# Altium schematic sheet Sheet1.SchDoc
size A; SheetNumber: 1; SheetTotal: 1
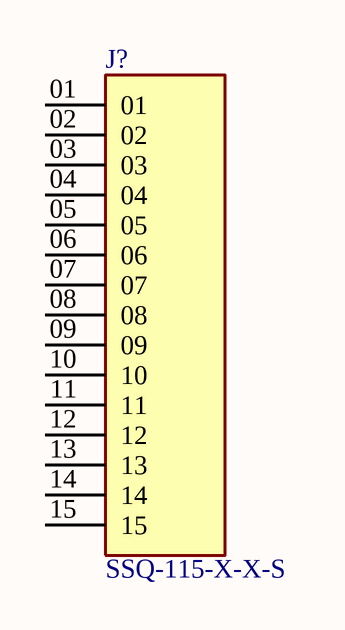
[diagram p0: Sheet1.SchDoc]

## Parts
J?  SSQ-115-X-X-S  [SAMTEC_SSQ-115-X-X-S]

## Nets

Not connected (* = marked no-connect by the designer): J? 01 02 03 04 05 06 07 08 09 10 11 12 13 14 15

## Library data of the parts
J? = SSQ-115-X-X-S: MF: {'manufacturer': u'Samtec'}; Price: None; Value: *; Package: None; Availability: Unavailable; MP: SSQ-115-X-X-S